# Altium schematic sheet LPEDT_revA1_bikeit_POWER.SchDoc: Bike It Power Management (part 1 of 3)
size A3; Author: Madhukar Arora; DocumentNumber: 4; Revision: 1; SheetNumber: 2; SheetTotal: 4
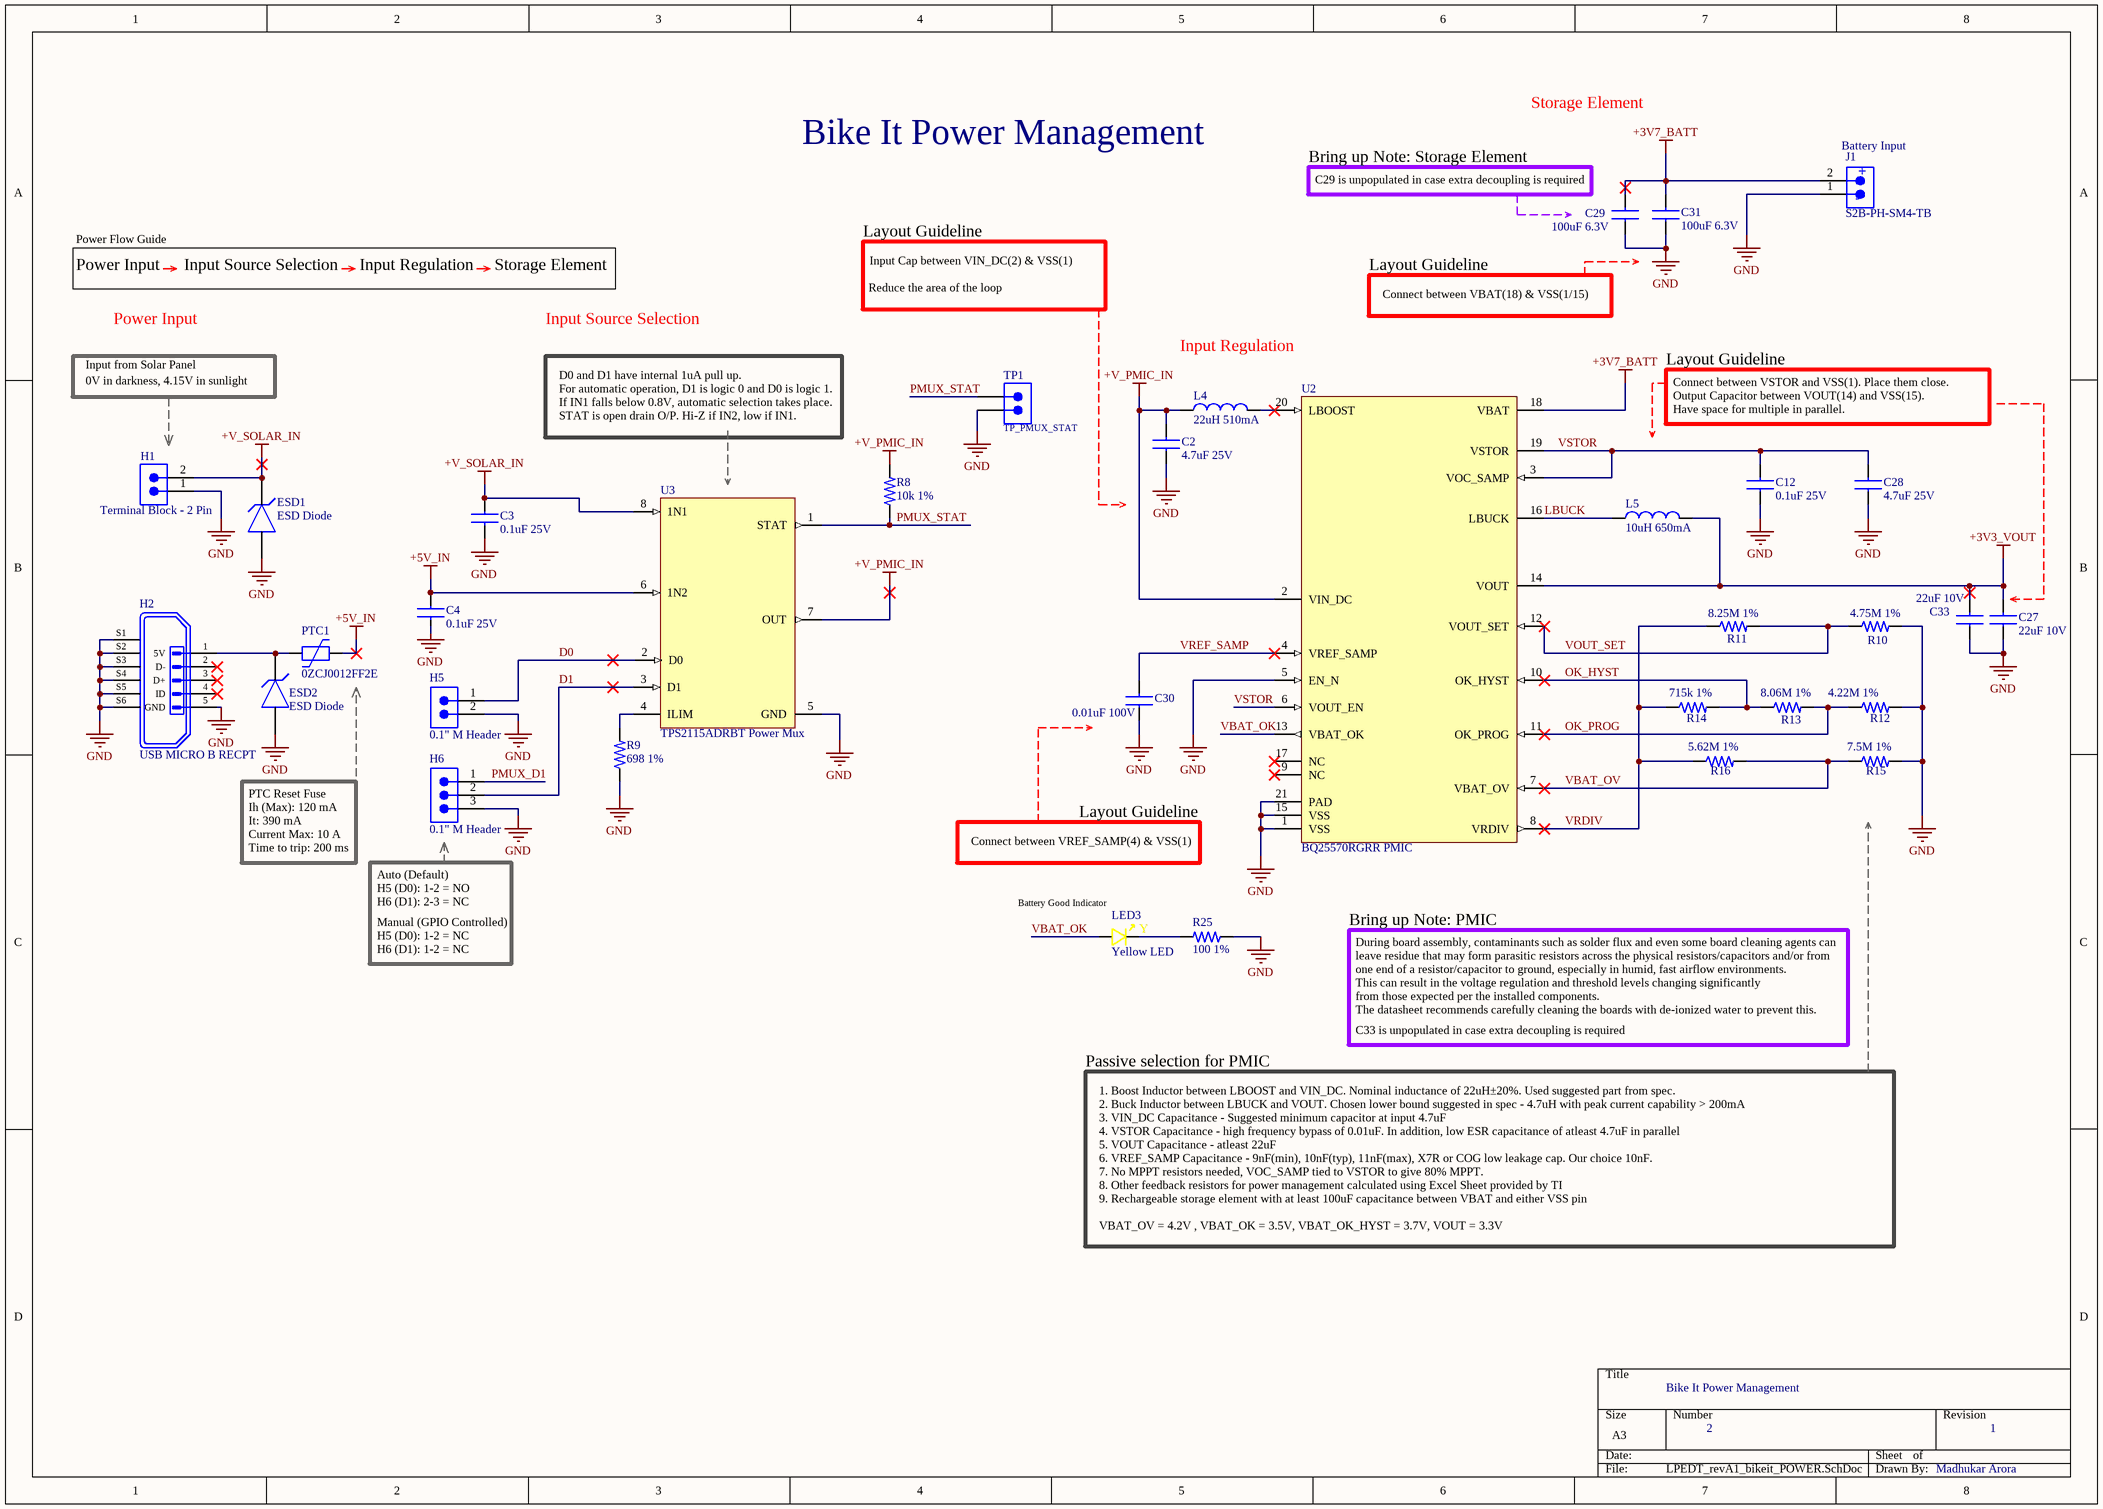
[diagram p0: LPEDT_revA1_bikeit_POWER.SchDoc]

## Parts
C2  4.7uF 25V  [CAP_0603_1.60mm*0.80mm]
C3  0.1uF 25V  [CAP_0603_1.60mm*0.80mm]
C4  0.1uF 25V  [CAP_0603_1.60mm*0.80mm]
C12  0.1uF 25V  [CAP_0603_1.60mm*0.80mm]
C27  22uF 10V  [CAP_0603_1.60mm*0.80mm]
C28  4.7uF 25V  [CAP_0603_1.60mm*0.80mm]
C29  100uF 6.3V  [CAPC3216X18N]
C30  0.01uF 100V  [CAP_0603_1.60mm*0.80mm]
C31  100uF 6.3V  [CAPC3216X18N]
C33  22uF 10V  [CAP_0603_1.60mm*0.80mm]
ESD1  ESD Diode  [ESD_SOD882]
ESD2  ESD Diode  [ESD_SOD882]
H1  Terminal Block - 2 Pin  [2-PIN_MALE_HEADER_01-282834-2]
H2  USB MICRO B RECPT  [MICROUSB_AMPHENOL_10118194-0001LF]
H5  0.1" M Header  [2-PIN_MALE_HEADER_01-IN]
H6  0.1" M Header  [3-PIN_MALE_HEADER_01-IN]
J1  S2B-PH-SM4-TB  [JST_S2B-PH-SM4-TB]
L4  22uH 510mA  [IND_WE-TPC-3816-S]
L5  10uH 650mA  [IND_WE-TPC-2813-TH]
LED3  Yellow LED  [LED_0603_YLW_WL-SMCW]
PTC1  0ZCJ0012FF2E  [PTCFuse_1206]
R8  10k 1%  [RES_0603_1608X06]
R9  698 1%  [RES_0603_1608X06]
R10  4.75M 1%  [RES_0603_1608X06]
R11  8.25M 1%  [RES_0603_1608X06]
R12  4.22M 1%  [RES_0603_1608X06]
R13  8.06M 1%  [RES_0603_1608X06]
R14  715k 1%  [RES_0603_1608X06]
R15  7.5M 1%  [RES_0603_1608X06]
R16  5.62M 1%  [RES_0603_1608X06]
R25  100 1%  [RES_0603_1608X06]
TP1  TP_PMUX_STAT  [TP10x_Probe]
U2  BQ25570RGRR PMIC  [PMIC_RGR0020A_NV]
U3  TPS2115ADRBT Power Mux  [PMUX_SON127P600-8N]

## Nets
+3V3_VOUT: C27.2 C33.2 L5.2 U2.14(VOUT)
+3V7_BATT: C29.2 C31.2 J1.2(+) U2.18(VBAT)
+5V_IN: C4.1 PTC1.2 U3.6(1N2)
+V_PMIC_IN: C2.1 L4.1 R8.2 U2.2(VIN_DC) U3.7(OUT)
+V_SOLAR_IN: C3.1 ESD1.1 H1.2(+) U3.8(1N1)
GND: C2.2 C3.2 C4.2 C12.2 C27.1 C28.2 C29.1 C30.2 C31.1 C33.1 ESD1.2 ESD2.2 H1.1(-) H2.5(GND) H2.S1 H2.S2 H2.S3 H2.S4 H2.S5 H2.S6 H5.2 H6.3 J1.1(-) R9.1 R10.2 R12.2 R15.2 R25.1 TP1.2(SIG) U2.1(VSS) U2.5(EN_N) U2.15(VSS) U2.21(PAD) U3.5(GND)
D0: H5.1 U3.2(D0)
D1: H6.2 U3.3(D1)
LBUCK: L5.1 U2.16(LBUCK)
OK_HYST: R13.1 R14.2 U2.10(OK_HYST)
OK_PROG: R12.1 R13.2 U2.11(OK_PROG)
PMUX_D1: H6.1
PMUX_STAT: R8.1 TP1.1(GND) U3.1(STAT)
VBAT_OK: LED3.A U2.13(VBAT_OK)
VBAT_OV: R15.1 R16.2 U2.7(VBAT_OV)
VOUT_SET: R10.1 R11.2 U2.12(VOUT_SET)
VRDIV: R11.1 R14.1 R16.1 U2.8(VRDIV)
VREF_SAMP: C30.1 U2.4(VREF_SAMP)
VSTOR: C12.1 C28.1 U2.3(VOC_SAMP) U2.6(VOUT_EN) U2.19(VSTOR)
NetESD2_1: ESD2.1 H2.1(5V) PTC1.1
NetL4_2: L4.2 U2.20(LBOOST)
NetLED3_C: LED3.C R25.2
NetR9_2: R9.2 U3.4(ILIM)

Not connected (* = marked no-connect by the designer): H2 2(D-)* 3(D+)* 4(ID)*; U2 9(NC)* 17(NC)*

## Notes on the sheet
- Storage Element
- Bike It Power Management
- Bring up Note: Storage Element
- C29 is unpopulated in case extra decoupling is required
- (near J1) Battery Input
- Power Flow Guide
- Layout Guideline
- Power Input
- Input Source Selection
- Input Regulation
- Reduce the area of the loop
- Input Cap between VIN_DC(2) & VSS(1)
- Connect between VBAT(18) & VSS(1/15)
- Input from Solar Panel
- 0V in darkness, 4.15V in sunlight
- D0 and D1 have internal 1uA pull up.
- For automatic operation, D1 is logic 0 and D0 is logic 1.
- If IN1 falls below 0.8V, automatic selection takes place.
- STAT is open drain O/P. Hi-Z if IN2, low if IN1.
- Connect between VSTOR and VSS(1). Place them close.
- Output Capacitor between VOUT(14) and VSS(15).
- Have space for multiple in parallel.
- PTC Reset Fuse
- It: 390 mA
- Ih (Max): 120 mA
- Current Max: 10 A
- Time to trip: 200 ms
- Connect between VREF_SAMP(4) & VSS(1)
- Auto (Default)
- H6 (D1): 2-3 = NC
- H5 (D0): 1-2 = NO
- (near LED3) Battery Good Indicator
- Manual (GPIO Controlled)
- H6 (D1): 1-2 = NC
- H5 (D0): 1-2 = NC
- Bring up Note: PMIC
- During board assembly, contaminants such as solder flux and even some board cleaning agents can
- leave residue that may form parasitic resistors across the physical resistors/capacitors and/or from
- one end of a resistor/capacitor to ground, especially in humid, fast airflow environments.
- This can result in the voltage regulation and threshold levels changing significantly
- from those expected per the installed components.
- The datasheet recommends carefully cleaning the boards with de-ionized water to prevent this.
- C33 is unpopulated in case extra decoupling is required
- Passive selection for PMIC
- 1. Boost Inductor between LBOOST and VIN_DC. Nominal inductance of 22uH±20%. Used suggested part from spec.
- 2. Buck Inductor between LBUCK and VOUT. Chosen lower bound suggested in spec - 4.7uH with peak current capability > 200mA
- 3. VIN_DC Capacitance - Suggested minimum capacitor at input 4.7uF
- 4. VSTOR Capacitance - high frequency bypass of 0.01uF. In addition, low ESR capacitance of atleast 4.7uF in parallel
- 5. VOUT Capacitance - atleast 22uF
- 6. VREF_SAMP Capacitance - 9nF(min), 10nF(typ), 11nF(max), X7R or COG low leakage cap. Our choice 10nF.
- 7. No MPPT resistors needed, VOC_SAMP tied to VSTOR to give 80% MPPT.
- 8. Other feedback resistors for power management calculated using Excel Sheet provided by TI
- 9. Rechargeable storage element with at least 100uF capacitance between VBAT and either VSS pin
- VBAT_OV = 4.2V , VBAT_OK = 3.5V, VBAT_OK_HYST = 3.7V, VOUT = 3.3V
- (in symbol 150060YS75000) Y